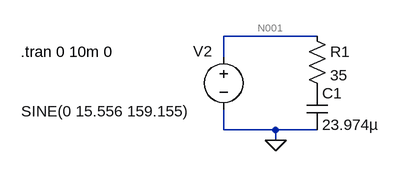
[diagram p0: schematic 1_3.asc]
1_3.asc, the LTspice schematic file:
Version 4.1
SHEET 1 880 680
WIRE 320 48 176 48
WIRE 176 80 176 48
WIRE 176 192 176 160
WIRE 256 192 176 192
WIRE 320 192 256 192
WIRE 256 208 256 192
FLAG 256 208 0
SYMBOL cap 304 128 R0
SYMATTR InstName C1
SYMATTR Value 23.974µ
SYMBOL res 304 32 R0
SYMATTR InstName R1
SYMATTR Value 35
SYMBOL voltage 176 64 R0
WINDOW 123 0 0 Left 0
WINDOW 39 24 124 Left 2
WINDOW 0 -47 7 Left 2
WINDOW 3 -311 99 Left 2
SYMATTR InstName V2
SYMATTR Value SINE(0 15.556 159.155)
TEXT -136 72 Left 2 !.tran 0 10m 0

The netlist it stands for:
* 1_3.asc
C1 P001 0 23.974µ
R1 N001 P001 35
V2 N001 0 SINE(0 15.556 159.155)
.tran 0 10m 0
.backanno
.end

* Results of the author's LTspice run, read from the files saved beside the schematic
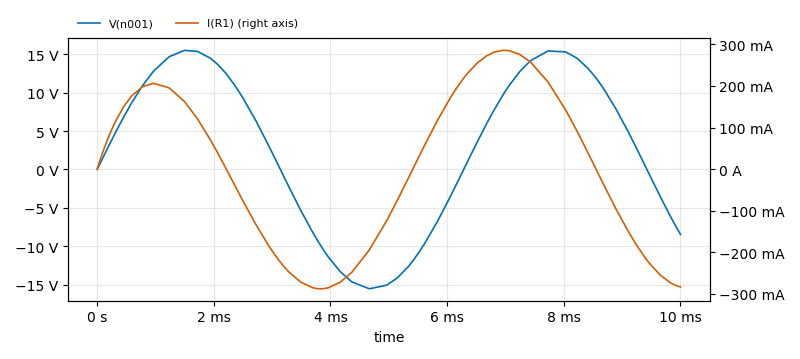
[diagram p1: Transient Analysis of 1_3.asc, plotted from the saved traces]
* Transient Analysis, 1 run:
*   V(n001): min -15.54 V, max 15.51 V, average 2.85 V, rms 10.73 V, last -8.463 V
*   I(R1): min -287.9 mA, max 285.6 mA, average 3.348 mA, rms 190.5 mA, last -283.5 mA